# Altium schematic sheet 07sdcard.SchDoc
size B
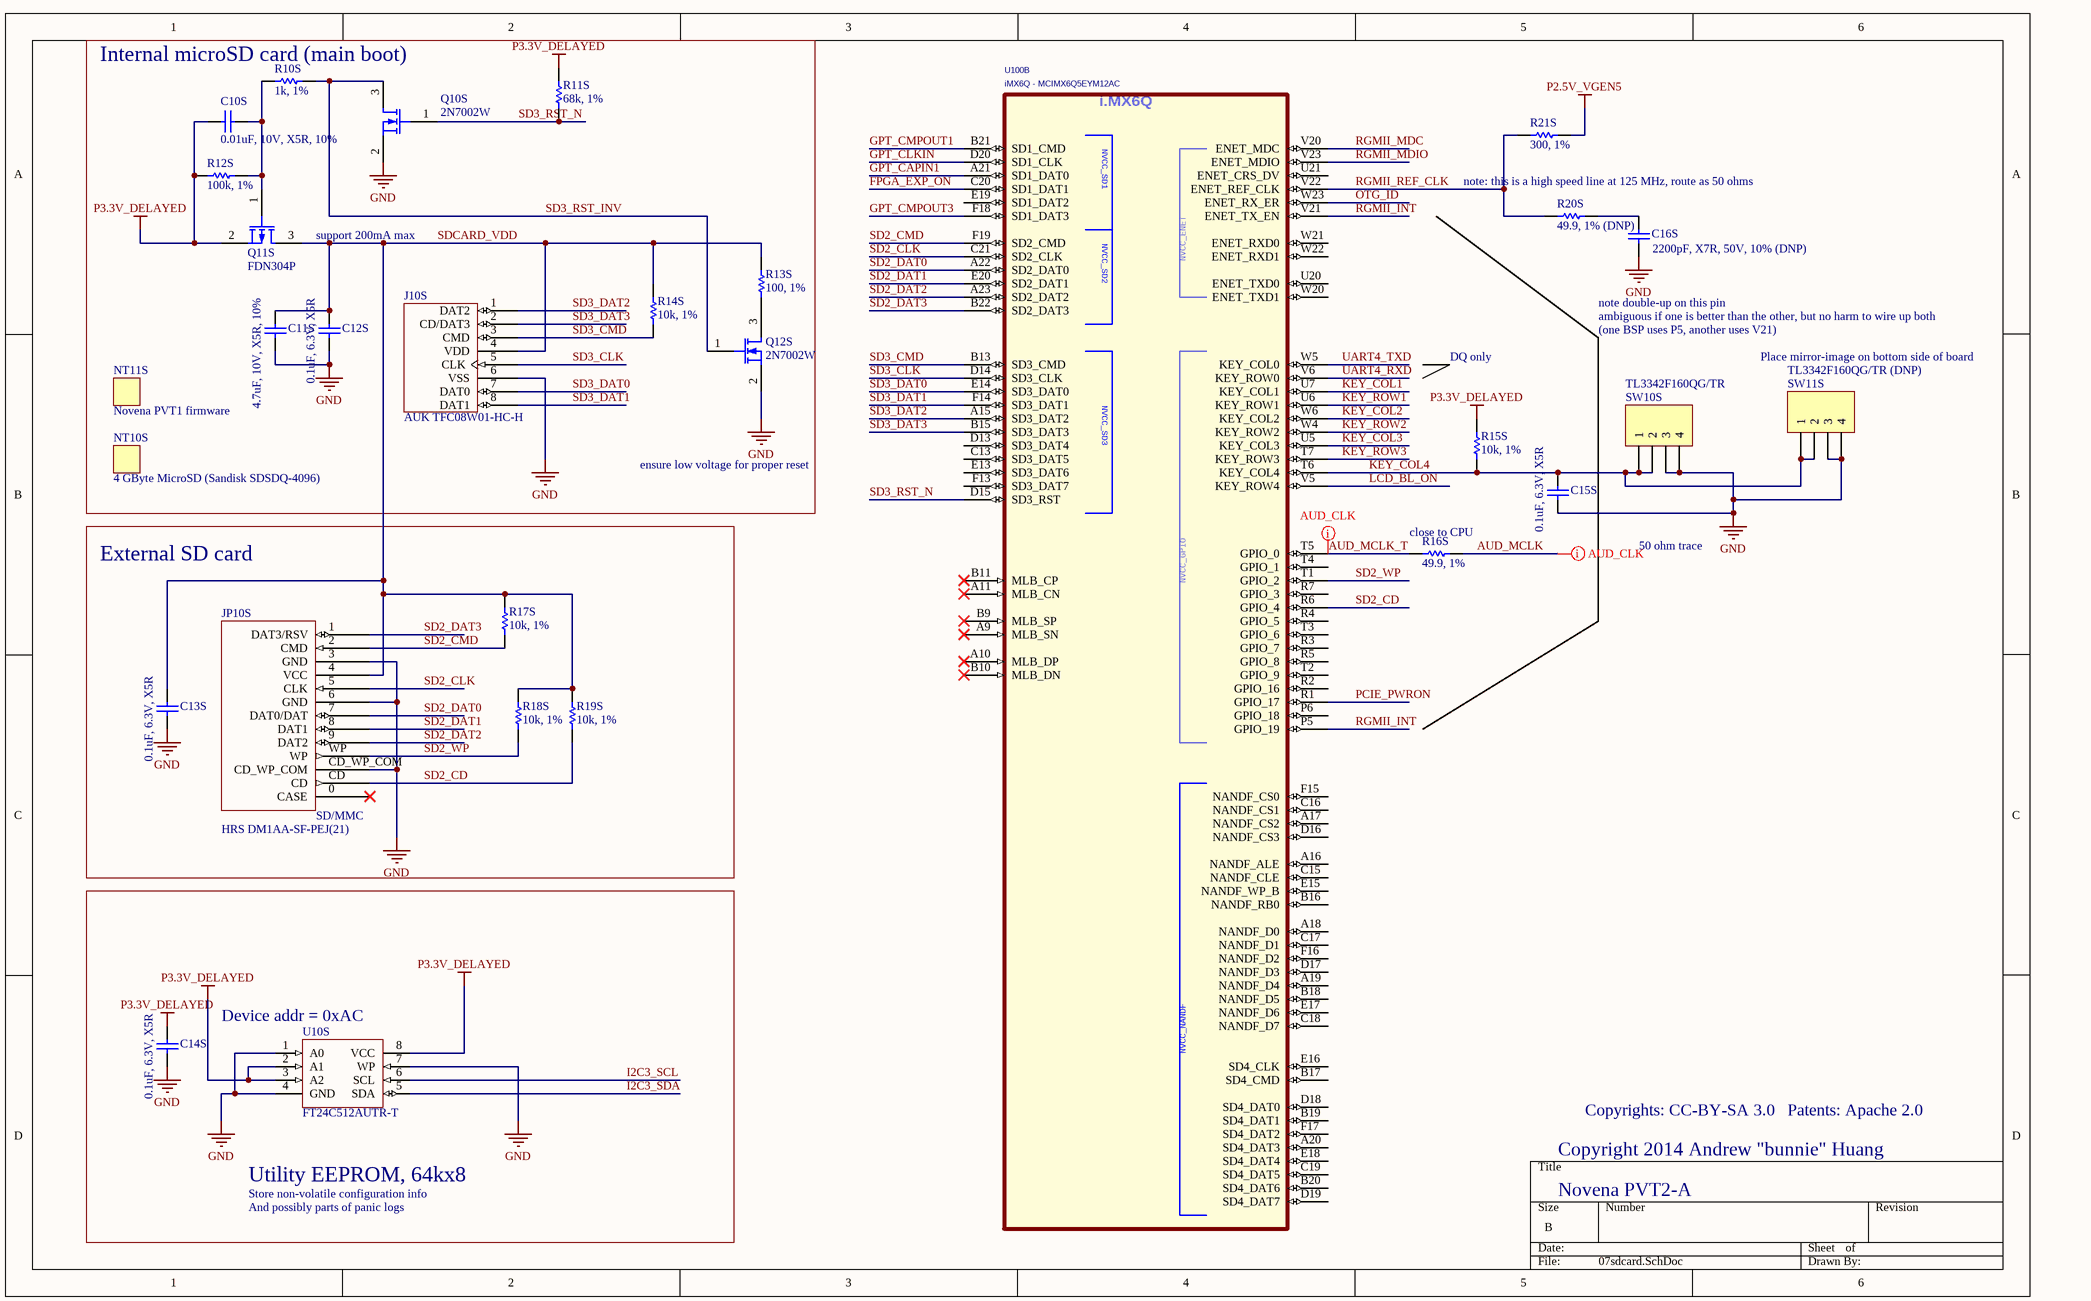
[diagram p0: 07sdcard.SchDoc]

## Parts
C10S  0.01uF, 10V, X5R, 10%  [CAPC0603N_B]
C11S  4.7uF, 10V, X5R, 10%  [CAPC1608N]
C12S  0.1uF, 6.3V, X5R  [CAPC0603N_B]
C13S  0.1uF, 6.3V, X5R  [CAPC0603N_B]
C14S  0.1uF, 6.3V, X5R  [CAPC0603N_B]
C15S  0.1uF, 6.3V, X5R  [CAPC0603N_B]
C16S  2200pF, X7R, 50V, 10% (DNP)  [CAPC1005N]
J10S  AUK TFC08W01-HC-H  [AUK_TFC08W01-HC-H]
JP10S  HRS DM1AA-SF-PEJ(21)  [HRS_DM1AA_SF_PEJ(21)]
NT10S  4 GByte MicroSD (Sandisk SDSDQ-4096)
NT11S  Novena PVT1 firmware
Q10S  2N7002W  [SOT323-3AN]
Q11S  FDN304P  [SOT23-3N]
Q12S  2N7002W  [SOT323-3AN]
R10S  1k, 1%  [RESC1005N]
R11S  68k, 1%  [RESC1005N]
R12S  100k, 1%  [RESC1005N]
R13S  100, 1%  [RESC1005N]
R14S  10k, 1%  [RESC1005N]
R15S  10k, 1%  [RESC1005N]
R16S  49.9, 1%  [RESC1005N]
R17S  10k, 1%  [RESC1005N]
R18S  10k, 1%  [RESC1005N]
R19S  10k, 1%  [RESC1005N]
R20S  49.9, 1% (DNP)  [RESC1005N]
R21S  300, 1%  [RESC1005N]
SW10S  TL3342F160QG/TR  [SWITCH_TS-1187A]
SW11S  TL3342F160QG/TR (DNP)  [SWITCH_TS-1187A]
U10S  FT24C512AUTR-T  [TSOP65P640-8AN]
U100  iMX6Q - MCIMX6Q5EYM12AC  [FREESCALE_BGA624C80P25X25_2100X2100X216]  (part B of 12)

## Blocks framed on the sheet
Internal microSD card (main boot): C10S C11S C12S J10S NT10S NT11S Q10S Q11S Q12S R10S R11S R12S R13S R14S
External SD card: C13S JP10S R17S R18S R19S
Utility EEPROM, 64kx8: C14S U10S

## Nets
GND: C11S.2 C12S.2 C13S.2 C14S.2 C15S.2 C16S.1 J10S.6(VSS) JP10S.3(GND) JP10S.6(GND) JP10S.CD_WP_COM Q10S.2(S) Q12S.2(S) SW10S.3 SW10S.4 SW11S.3 SW11S.4 U10S.1(A0) U10S.4(GND) U10S.7(WP)
P2.5V_VGEN5: R21S.2
P3.3V_DELAYED: C10S.2 C14S.1 Q11S.2(S) R11S.1 R12S.2 R15S.1 U10S.2(A1) U10S.3(A2) U10S.8(VCC)
AUD_MCLK: R16S.1
AUD_MCLK_T: R16S.2 U100.T5(GPIO_0)
FPGA_EXP_ON: U100.C20(SD1_DAT1)
GPT_CAPIN1: U100.A21(SD1_DAT0)
GPT_CLKIN: U100.D20(SD1_CLK)
GPT_CMPOUT1: U100.B21(SD1_CMD)
GPT_CMPOUT3: U100.F18(SD1_DAT3)
I2C3_SCL: U10S.6(SCL)
I2C3_SDA: U10S.5(SDA)
KEY_COL1: U100.U7(KEY_COL1)
KEY_COL2: U100.W6(KEY_COL2)
KEY_COL3: U100.U5(KEY_COL3)
KEY_COL4: C15S.1 R15S.2 SW10S.1 SW10S.2 SW11S.1 SW11S.2 U100.T6(KEY_COL4)
KEY_ROW1: U100.U6(KEY_ROW1)
KEY_ROW2: U100.W4(KEY_ROW2)
KEY_ROW3: U100.T7(KEY_ROW3)
LCD_BL_ON: U100.V5(KEY_ROW4)
OTG_ID: U100.W23(ENET_RX_ER)
PCIE_PWRON: U100.R1(GPIO_17)
RGMII_INT: U100.P5(GPIO_19) U100.V21(ENET_TX_EN)
RGMII_MDC: U100.V20(ENET_MDC)
RGMII_MDIO: U100.V23(ENET_MDIO)
RGMII_REF_CLK: R20S.1 R21S.1 U100.V22(ENET_REF_CLK)
SD2_CD: JP10S.CD R19S.2 U100.R6(GPIO_4)
SD2_CLK: JP10S.5(CLK) U100.C21(SD2_CLK)
SD2_CMD: JP10S.2(CMD) R17S.2 U100.F19(SD2_CMD)
SD2_DAT0: JP10S.7(DAT0/DAT) U100.A22(SD2_DAT0)
SD2_DAT1: JP10S.8(DAT1) U100.E20(SD2_DAT1)
SD2_DAT2: JP10S.9(DAT2) U100.A23(SD2_DAT2)
SD2_DAT3: JP10S.1(DAT3/RSV) U100.B22(SD2_DAT3)
SD2_WP: JP10S.WP R18S.2 U100.T1(GPIO_2)
SD3_CLK: J10S.5(CLK) U100.D14(SD3_CLK)
SD3_CMD: J10S.3(CMD) R14S.2 U100.B13(SD3_CMD)
SD3_DAT0: J10S.7(DAT0) U100.E14(SD3_DAT0)
SD3_DAT1: J10S.8(DAT1) U100.F14(SD3_DAT1)
SD3_DAT2: J10S.1(DAT2) U100.A15(SD3_DAT2)
SD3_DAT3: J10S.2(CD/DAT3) U100.B15(SD3_DAT3)
SD3_RST_INV: Q10S.3(D) Q12S.1(G) R10S.1
SD3_RST_N: Q10S.1(G) R11S.2 U100.D15(SD3_RST)
SDCARD_VDD: C11S.1 C12S.1 C13S.1 J10S.4(VDD) JP10S.4(VCC) Q11S.3(D) R13S.1 R14S.1 R17S.1 R18S.1 R19S.1
UART4_RXD: U100.V6(KEY_ROW0)
UART4_TXD: U100.W5(KEY_COL0)
NetC10S_1: C10S.1 Q11S.1(G) R10S.2 R12S.1
NetC16S_2: C16S.2 R20S.2
NetQ12S_3: Q12S.3(D) R13S.2

Not connected (* = marked no-connect by the designer): JP10S 0(CASE)*; U100 A9(MLB_SN)* A10(MLB_DP)* A11(MLB_CN)* A16(NANDF_ALE) A17(NANDF_CS2) A18(NANDF_D0) A19(NANDF_D4) A20(SD4_DAT3) B9(MLB_SP)* B10(MLB_DN)* B11(MLB_CP)* B16(NANDF_RB0) B17(SD4_CMD) B18(NANDF_D5) B19(SD4_DAT1) B20(SD4_DAT6) C13(SD3_DAT5) C15(NANDF_CLE) C16(NANDF_CS1) C17(NANDF_D1) C18(NANDF_D7) C19(SD4_DAT5) D13(SD3_DAT4) D16(NANDF_CS3) D17(NANDF_D3) D18(SD4_DAT0) D19(SD4_DAT7) E13(SD3_DAT6) E15(NANDF_WP_B) E16(SD4_CLK) E17(NANDF_D6) E18(SD4_DAT4) E19(SD1_DAT2) F13(SD3_DAT7) F15(NANDF_CS0) F16(NANDF_D2) F17(SD4_DAT2) P6(GPIO_18) R2(GPIO_16) R3(GPIO_7) R4(GPIO_5) R5(GPIO_8) R7(GPIO_3) T2(GPIO_9) T3(GPIO_6) T4(GPIO_1) U20(ENET_TXD0) U21(ENET_CRS_DV) W20(ENET_TXD1) W21(ENET_RXD0) W22(ENET_RXD1)

## Layout directives
net class AUD_CLK: AUD_MCLK, AUD_MCLK_T

## Notes on the sheet
- (near Q11S) support 200mA max
- note: this is a high speed line at 125 MHz, route as 50 ohms
- note double-up on this pin
- DQ only
- ambiguous if one is better than the other, but no harm to wire up both
- (one BSP uses P5, another uses V21)
- Place mirror-image on bottom side of board
- ensure low voltage for proper reset
- (near R16S) close to CPU
- 50 ohm trace
- (near U10S) Device addr = 0xAC
- Copyrights: CC-BY-SA 3.0
- Patents: Apache 2.0
- Copyright 2014 Andrew "bunnie" Huang
- Store non-volatile configuration info
- And possibly parts of panic logs
- Novena PVT2-A
- (in symbol HRS_DM1AA_SF_PEJ(21)) SD/MMC
- (in symbol PCIMX6Q6VV1A, part B) i.MX6Q

## Library data of the parts
C10S C11S C12S C13S C14S C15S C16S = Cap Semi: Capacitor (Semiconductor SIM Model); Published: 8-Jun-2000; LatestRevisionDate: 17-Jul-2002; LatestRevisionNote: Re-released for DXP Platform.; PackageReference: C1206; Publisher: Altium Limited
J10S = MICRO_SD: Captive Micro-SD card for firmware images
JP10S = HRS_DM1AA_SF_PEJ(21): SD card connector
NT10S NT11S = NOTE: Placeholder for non-electrical BOM items
Q10S Q12S = MOSFET-N: N-Channel MOSFET; Published: 8-Jun-2000; LatestRevisionDate: 17-Jul-2002; LatestRevisionNote: Re-released for DXP Platform.; PackageVersion: 1995/1996; PackageReference: E3; Publisher: Altium Limited
Q11S = MOSFET-P: P-Channel MOSFET; Published: 8-Jun-2000; LatestRevisionDate: 17-Jul-2002; LatestRevisionNote: Re-released for DXP Platform.; PackageVersion: 1995/1996; PackageReference: E3; Publisher: Altium Limited; PackageDescription: TO, Flat Index; 3 In-Line, Axial Leads; Body Dia. 4.6mm; Lead Dia. 0.5 mm (max)
R10S R11S R13S R14S R15S R16S R17S R18S R19S R20S R21S = Res1: Resistor; Value: 100k; Published: 8-Jun-2000; LatestRevisionDate: 17-Jul-2002; LatestRevisionNote: Re-released for DXP Platform.; PackageReference: AXIAL-0.3; Publisher: Altium Limited
R12S = Res1: Resistor; Published: 8-Jun-2000; LatestRevisionDate: 17-Jul-2002; LatestRevisionNote: Re-released for DXP Platform.; PackageReference: AXIAL-0.3; Publisher: Altium Limited; Value: 100k
SW10S SW11S = Header 4: Chi Fung TS-1187A; LatestRevisionDate: 17-Jul-2002; LatestRevisionNote: Re-released for DXP Platform.; Publisher: Altium Limited
U10S = AT24C08: 8kbit (1kx8) I2C EEPROM
U100 = PCIMX6Q6VV1A: PCIMX6Q5EVT10AC; AGILE_PN: TMP-WF-14526; MFG_NAME01: Freescale Semiconductor; PRE_APN: 344-01218; MFG_PN01: PCIMX6Q6VV1A; ROHS: Yes; HEIGHT: 2.16MM